# Altium schematic sheet HFM_Power_Supply_V1.SchDoc
size A4
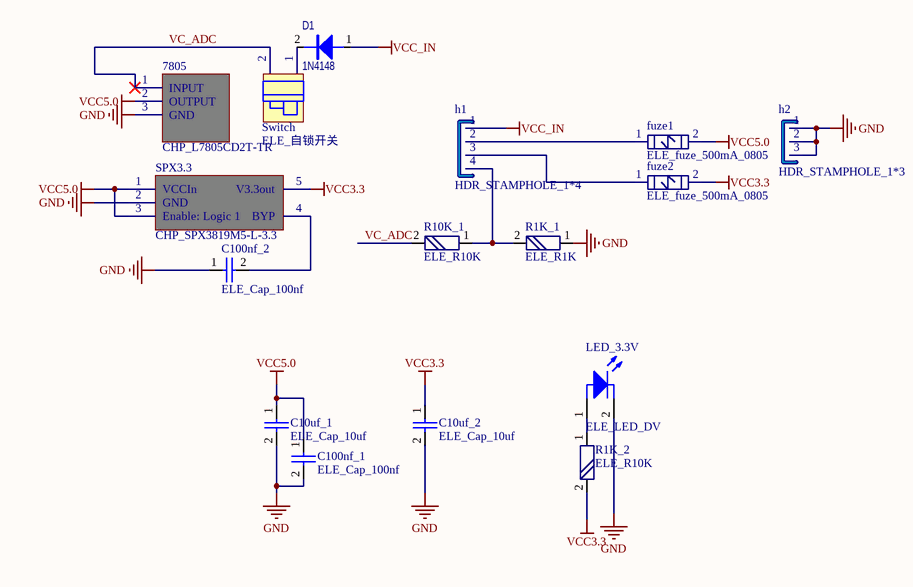
[diagram p0: HFM_Power_Supply_V1.SchDoc]

## Parts
7805  CHP_L7805CD2T-TR  [CHP_TOD2PAK]
C10uf_1  ELE_Cap_10uf  [ELE_0603_P]
C10uf_2  ELE_Cap_10uf  [ELE_0603_P]
C100nf_1  ELE_Cap_100nf  [ELE_0603_P]
C100nf_2  ELE_Cap_100nf  [ELE_0603_P]
D1  1N4148  [ELE_D1206]
fuze1  ELE_fuze_500mA_0805  [ELE_FUZE_0805]
fuze2  ELE_fuze_500mA_0805  [ELE_FUZE_0805]
h1  HDR_STAMPHOLE_1*4  [HDR_STAMPHOLE_2.00_DH_1*4]
h2  HDR_STAMPHOLE_1*3  [HDR_STAMPHOLE_2.00_DH_1*3]
LED_3.3V  ELE_LED_DV  [ELE_LED_DV]
R1K_1  ELE_R1K  [ELE_0603_P]
R1K_2  ELE_R10K  [ELE_0603_P]
R10K_1  ELE_R10K  [ELE_0603_P]
SPX3.3  CHP_SPX3819M5-L-3.3  [CHP_SOT23_P_5P]
Switch  ELE_自锁开关  [ELE_自锁开关_DV_5.8*5.8]

## Nets
GND: 7805.3(GND) C10uf_1.2 C10uf_2.2 C100nf_1.2 C100nf_2.1 h2.1 h2.2 h2.3 LED_3.3V.2 R1K_1.1 SPX3.3.2(GND)
VCC3.3: C10uf_2.1 fuze2.2 R1K_2.2 SPX3.3.5(V3.3out)
VCC5.0: 7805.2(OUTPUT) C10uf_1.1 C100nf_1.1 fuze1.2 SPX3.3.1(VCCIn) SPX3.3.3(Enable:_Logic_1)
VCC_IN: D1.1 h1.1
VC_ADC: 7805.1(INPUT) R10K_1.2 Switch.2
NetC100nf_2_2: C100nf_2.2 SPX3.3.4(BYP)
NetD1_2: D1.2 Switch.1
Netfuze1_1: fuze1.1 h1.2
Netfuze2_1: fuze2.1 h1.3
Neth1_4: h1.4 R1K_1.2 R10K_1.1
NetLED_3.3V_1: LED_3.3V.1 R1K_2.1

## Library data of the parts
7805 = CHP_L7805CD2T-TR: 5.0稳压器
C10uf_1 C10uf_2 = ELE_Cap_10uf: 电容10uf固定
C100nf_1 C100nf_2 = ELE_Cap_100nf: 电容100nf固定
D1 = ELE_Diode: 二极管
LED_3.3V = ELE_LED_DV: 发光二极管 直插; Published: 8-Jun-2000; LatestRevisionDate: 17-Jul-2002; LatestRevisionNote: Re-released for DXP Platform.; PackageDocument: Feb-2002; PackageReference: 3.2X1.6X1.1; Publisher: Altium Limited
R1K_1 = ELE_R1K: 电阻1K固定
R1K_2 R10K_1 = ELE_R10K: 电阻10K固定
SPX3.3 = CHP_SPX3819M5-L-3.3: 3.3V稳压